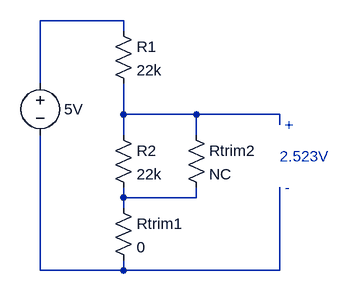
[diagram p0: schematic demo_setup_trim.asc]
demo_setup_trim.asc, the LTspice schematic file:
Version 4
SHEET 1 880 680
WIRE 240 16 112 16
WIRE 240 32 240 16
WIRE 112 112 112 16
WIRE 240 160 240 112
WIRE 352 160 240 160
WIRE 480 160 352 160
WIRE 480 176 480 160
WIRE 240 192 240 160
WIRE 352 192 352 160
WIRE 240 288 240 272
WIRE 352 288 352 272
WIRE 352 288 240 288
WIRE 240 304 240 288
WIRE 112 400 112 192
WIRE 240 400 240 384
WIRE 240 400 112 400
WIRE 480 400 480 272
WIRE 480 400 240 400
SYMBOL voltage 112 96 R0
WINDOW 0 24 16 Invisible 2
WINDOW 3 37 56 Left 2
SYMATTR InstName V1
SYMATTR Value 5V
SYMBOL res 224 176 R0
SYMATTR InstName R2
SYMATTR Value 22k
SYMBOL res 224 16 R0
SYMATTR InstName R1
SYMATTR Value 22k
SYMBOL res 336 176 R0
SYMATTR InstName Rtrim2
SYMATTR Value NC
SYMBOL res 224 288 R0
SYMATTR InstName Rtrim1
SYMATTR Value 0
TEXT 480 224 Left 2 ;2.523V
TEXT 488 176 Left 2 ;+
TEXT 488 272 Left 2 ;-

The netlist it stands for:
* demo_setup_trim.asc
V1 N001 N004 5V
R2 N002 N003 22k
R1 N001 N002 22k
Rtrim2 N002 N003 NC
Rtrim1 N003 N004 0
* 2.523V
* +
* -
.backanno
.end